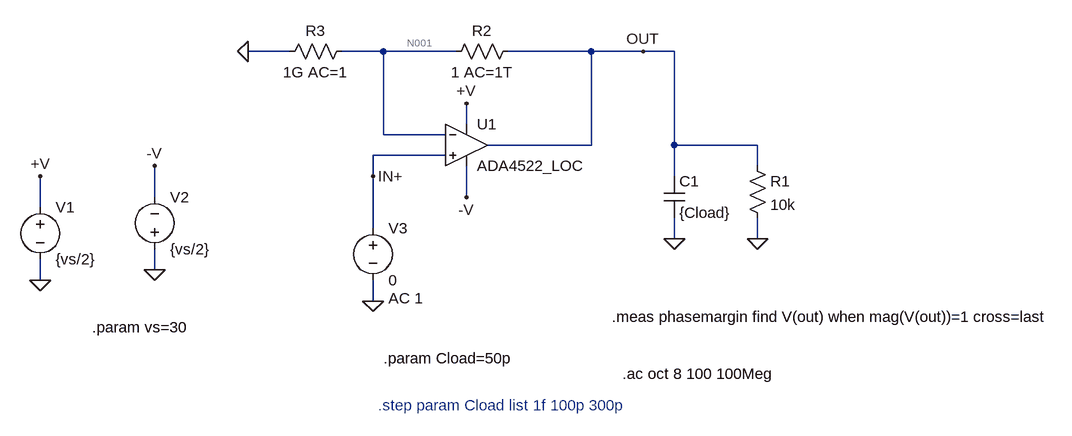
[diagram p0: schematic ADA4522_AC_OpenLoopLOC.asc]
ADA4522_AC_OpenLoopLOC.asc, the LTspice schematic file:
Version 4
SHEET 1 1240 760
WIRE 0 64 -64 64
WIRE 144 64 80 64
WIRE 256 64 144 64
WIRE 464 64 336 64
WIRE 544 64 464 64
WIRE 592 64 544 64
WIRE 272 176 272 144
WIRE 144 192 144 64
WIRE 240 192 144 192
WIRE 464 208 464 64
WIRE 464 208 304 208
WIRE 592 208 592 64
WIRE 720 208 592 208
WIRE 240 224 128 224
WIRE 720 240 720 208
WIRE 128 256 128 224
WIRE 592 256 592 208
WIRE -208 288 -208 240
WIRE 272 288 272 240
WIRE -384 304 -384 256
WIRE 128 336 128 256
WIRE 592 352 592 320
WIRE 720 352 720 320
WIRE -208 400 -208 368
WIRE -384 416 -384 384
WIRE 128 448 128 416
FLAG -384 416 0
FLAG -208 400 0
FLAG -384 256 +V
FLAG -208 240 -V
FLAG 272 144 +V
FLAG 272 288 -V
FLAG 592 352 0
FLAG 720 352 0
FLAG 128 448 0
FLAG 128 256 IN+
FLAG 544 64 OUT
FLAG -64 64 0
SYMBOL voltage -384 288 R0
SYMATTR InstName V1
SYMATTR Value {vs/2}
SYMBOL voltage -208 384 M180
WINDOW 0 24 96 Left 2
WINDOW 3 24 16 Left 2
WINDOW 123 0 0 Left 2
WINDOW 39 24 -12 Left 2
SYMATTR InstName V2
SYMATTR Value {vs/2}
SYMBOL cap 576 256 R0
SYMATTR InstName C1
SYMATTR Value {Cload}
SYMBOL res 704 224 R0
SYMATTR InstName R1
SYMATTR Value 10k
SYMBOL voltage 128 320 R0
WINDOW 123 24 124 Left 2
WINDOW 39 24 124 Left 2
SYMATTR Value2 AC 1
SYMATTR InstName V3
SYMATTR Value 0
SYMBOL res 352 48 R90
WINDOW 0 0 56 VBottom 2
WINDOW 3 32 56 VTop 2
SYMATTR InstName R2
SYMATTR Value 1 AC=1T
SYMBOL res 96 48 R90
WINDOW 0 0 56 VBottom 2
WINDOW 3 32 56 VTop 2
SYMATTR InstName R3
SYMATTR Value 1G AC=1
SYMBOL ADA4522_LOC 272 144 R0
SYMATTR InstName U1
TEXT 136 608 Left 2 ;.step param Cload list 1f 100p 300p
TEXT 144 536 Left 2 !.param Cload=50p
TEXT -304 488 Left 2 !.param vs=30
TEXT 512 560 Left 2 !.ac oct 8 100 100Meg
TEXT 496 472 Left 2 !.meas phasemargin find V(out) when mag(V(out))=1 cross=last

The netlist it stands for:
* ADA4522_AC_OpenLoopLOC.asc
V1 +V 0 {vs/2}
V2 0 -V {vs/2}
C1 OUT 0 {Cload}
R1 OUT 0 10k
V3 IN+ 0 0 AC 1
R2 OUT N001 1 AC=1T
R3 N001 0 1G AC=1
* U1: ADA4522_LOC (symbol ADA4522_LOC not available, pins judged from their places): In+=IN+ In-=N001 V+=+V V-=-V OUT=OUT
* .step param Cload list 1f 100p 300p
.param Cload=50p
.param vs=30
.ac oct 8 100 100Meg
.meas phasemargin find V(out) when mag(V(out))=1 cross=last
.backanno
.end

* Results of the author's LTspice run, read from the files saved beside the schematic
* Operating Point, zero values left out:
*   V(+v) = 15 V
*   V(-v) = -15 V
*   V(out) = -15 µV
*   V(n001) = -15 µV
*   I(R2) = -587.4 pA
*   I(R1) = -1.5 nA
*   I(V3) = 387.4 pA
*   I(V2) = -400 µA
*   I(V1) = -400 µA
*   Ix(u2:1) = -387.4 pA
*   Ix(u2:2) = -587.4 pA
*   Ix(u2:99) = 400 µA
*   Ix(u2:50) = -400 µA
*   Ix(u2:34) = 2.088 nA